# EAGLE design M5R_I2C_MUX (EAGLE 9.6.2)
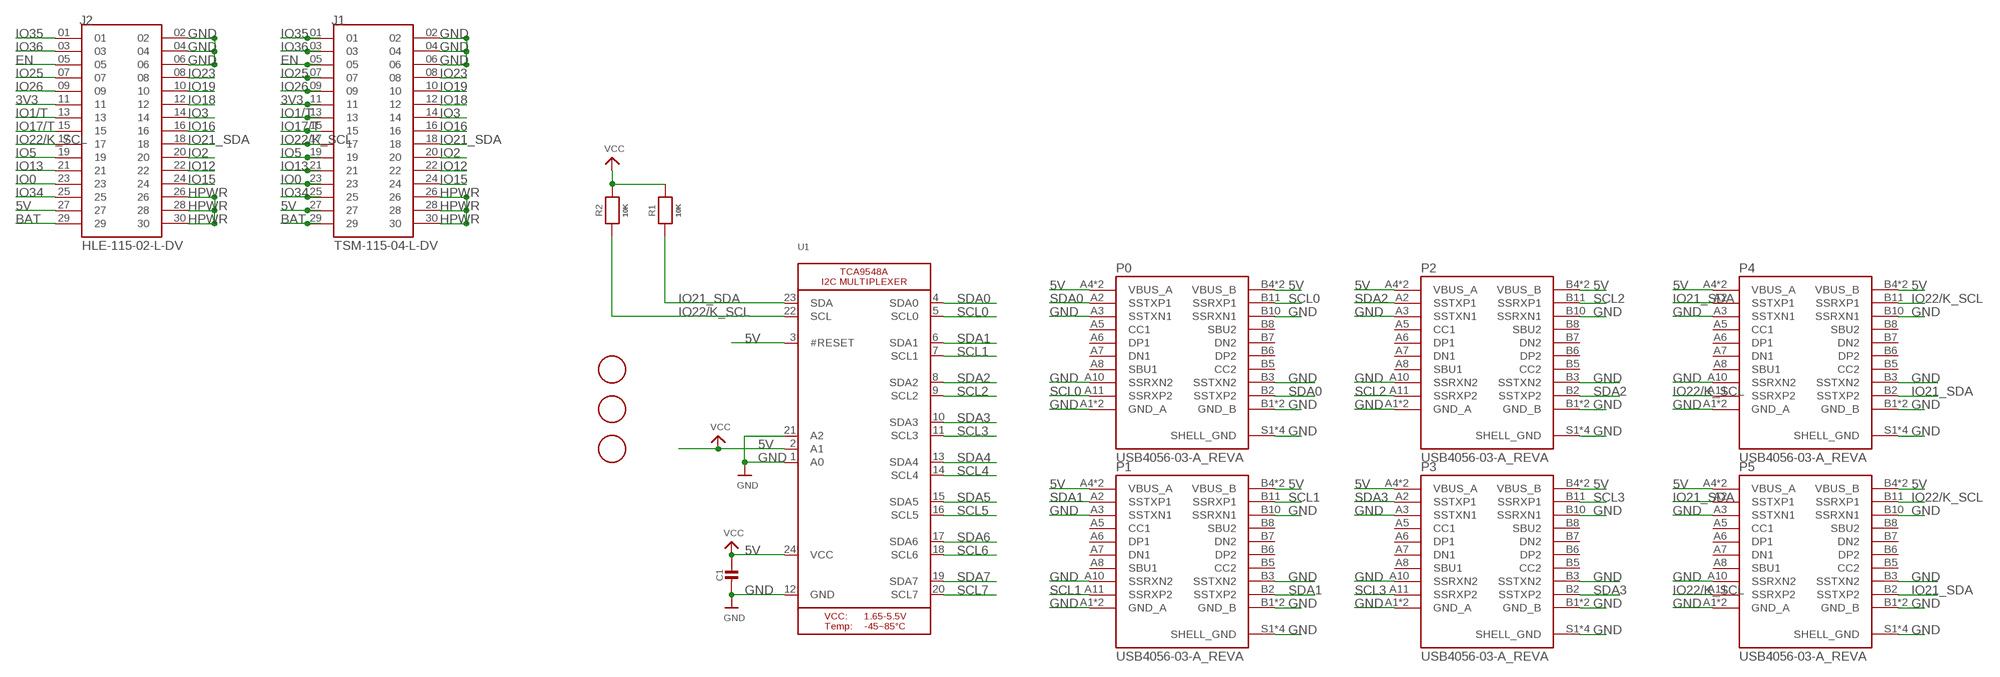
[diagram p0: schematic, sheet 1]

## Parts
C1  CAP_CERAMIC0805-NOOUTLINE  [0805-NO]
J1  TSM-115-04-L-DV  [SAMTEC_TSM-115-04-L-DV]
J2  HLE-115-02-L-DV  [SAMTEC_HLE-115-02-L-DV]
P0  USB4056-03-A_REVA  [GCT_USB4056-03-A_REVA]
P1  USB4056-03-A_REVA  [GCT_USB4056-03-A_REVA]
P2  USB4056-03-A_REVA  [GCT_USB4056-03-A_REVA]
P3  USB4056-03-A_REVA  [GCT_USB4056-03-A_REVA]
P4  USB4056-03-A_REVA  [GCT_USB4056-03-A_REVA]
P5  USB4056-03-A_REVA  [GCT_USB4056-03-A_REVA]
R1  10K  RESISTOR_0805  [0805]
R2  10K  RESISTOR_0805  [0805]
U1  TCA9548A  [TSSOP24]
U$3  FIDUCIAL  [FIDUCIAL_1MM]
U$4  FIDUCIAL  [FIDUCIAL_1MM]
U$5  FIDUCIAL  [FIDUCIAL_1MM]

## Nets
3V3: J1.11 J2.11
5V: C1.1 J1.27 J2.27 P0.A4(VBUS_A) P0.A9(VBUS_A) P0.B4(VBUS_B) P0.B9(VBUS_B) P1.A4(VBUS_A) P1.A9(VBUS_A) P1.B4(VBUS_B) P1.B9(VBUS_B) P2.A4(VBUS_A) P2.A9(VBUS_A) P2.B4(VBUS_B) P2.B9(VBUS_B) P3.A4(VBUS_A) P3.A9(VBUS_A) P3.B4(VBUS_B) P3.B9(VBUS_B) P4.A4(VBUS_A) P4.A9(VBUS_A) P4.B4(VBUS_B) P4.B9(VBUS_B) P5.A4(VBUS_A) P5.A9(VBUS_A) P5.B4(VBUS_B) P5.B9(VBUS_B) R1.2 R2.2 U1.2(A1) U1.3(#RESET) U1.24(VCC) ; supply symbol labelled VCC
BAT: J1.29 J2.29
EN: J1.05 J2.05
GND [New Class]: C1.2 J1.02 J1.04 J1.06 J2.02 J2.04 J2.06 P0.A1(GND_A) P0.A3(SSTXN1) P0.A10(SSRXN2) P0.A12(GND_A) P0.B1(GND_B) P0.B3(SSTXN2) P0.B10(SSRXN1) P0.B12(GND_B) P0.S1(SHELL_GND) P0.S2(SHELL_GND) P0.S3(SHELL_GND) P0.S4(SHELL_GND) P1.A1(GND_A) P1.A3(SSTXN1) P1.A10(SSRXN2) P1.A12(GND_A) P1.B1(GND_B) P1.B3(SSTXN2) P1.B10(SSRXN1) P1.B12(GND_B) P1.S1(SHELL_GND) P1.S2(SHELL_GND) P1.S3(SHELL_GND) P1.S4(SHELL_GND) P2.A1(GND_A) P2.A3(SSTXN1) P2.A10(SSRXN2) P2.A12(GND_A) P2.B1(GND_B) P2.B3(SSTXN2) P2.B10(SSRXN1) P2.B12(GND_B) P2.S1(SHELL_GND) P2.S2(SHELL_GND) P2.S3(SHELL_GND) P2.S4(SHELL_GND) P3.A1(GND_A) P3.A3(SSTXN1) P3.A10(SSRXN2) P3.A12(GND_A) P3.B1(GND_B) P3.B3(SSTXN2) P3.B10(SSRXN1) P3.B12(GND_B) P3.S1(SHELL_GND) P3.S2(SHELL_GND) P3.S3(SHELL_GND) P3.S4(SHELL_GND) P4.A1(GND_A) P4.A3(SSTXN1) P4.A10(SSRXN2) P4.A12(GND_A) P4.B1(GND_B) P4.B3(SSTXN2) P4.B10(SSRXN1) P4.B12(GND_B) P4.S1(SHELL_GND) P4.S2(SHELL_GND) P4.S3(SHELL_GND) P4.S4(SHELL_GND) P5.A1(GND_A) P5.A3(SSTXN1) P5.A10(SSRXN2) P5.A12(GND_A) P5.B1(GND_B) P5.B3(SSTXN2) P5.B10(SSRXN1) P5.B12(GND_B) P5.S1(SHELL_GND) P5.S2(SHELL_GND) P5.S3(SHELL_GND) P5.S4(SHELL_GND) U1.1(A0) U1.12(GND) U1.21(A2)
HPWR: J1.26 J1.28 J1.30 J2.26 J2.28 J2.30
IO0: J1.23 J2.23
IO1/T: J1.13 J2.13
IO2: J1.20 J2.20
IO3: J1.14 J2.14
IO5: J1.19 J2.19
IO12: J1.22 J2.22
IO13: J1.21 J2.21
IO15: J1.24 J2.24
IO16: J1.16 J2.16
IO17/T: J1.15 J2.15
IO18: J1.12 J2.12
IO19: J1.10 J2.10
IO21_SDA: J1.18 J2.18 P4.A2(SSTXP1) P4.B2(SSTXP2) P5.A2(SSTXP1) P5.B2(SSTXP2) R1.1 U1.23(SDA)
IO22/K_SCL: J1.17 J2.17 P4.A11(SSRXP2) P4.B11(SSRXP1) P5.A11(SSRXP2) P5.B11(SSRXP1) R2.1 U1.22(SCL)
IO23: J1.08 J2.08
IO25: J1.07 J2.07
IO26: J1.09 J2.09
IO34: J1.25 J2.25
IO35: J1.01 J2.01
IO36: J1.03 J2.03
SCL0: P0.A11(SSRXP2) P0.B11(SSRXP1) U1.5(SCL0)
SCL1: P1.A11(SSRXP2) P1.B11(SSRXP1) U1.7(SCL1)
SCL2: P2.A11(SSRXP2) P2.B11(SSRXP1) U1.9(SCL2)
SCL3: P3.A11(SSRXP2) P3.B11(SSRXP1) U1.11(SCL3)
SCL4: U1.14(SCL4)
SCL5: U1.16(SCL5)
SCL6: U1.18(SCL6)
SCL7: U1.20(SCL7)
SDA0: P0.A2(SSTXP1) P0.B2(SSTXP2) U1.4(SDA0)
SDA1: P1.A2(SSTXP1) P1.B2(SSTXP2) U1.6(SDA1)
SDA2: P2.A2(SSTXP1) P2.B2(SSTXP2) U1.8(SDA2)
SDA3: P3.A2(SSTXP1) P3.B2(SSTXP2) U1.10(SDA3)
SDA4: U1.13(SDA4)
SDA5: U1.15(SDA5)
SDA6: U1.17(SDA6)
SDA7: U1.19(SDA7)
Unconnected: P0.A5(CC1) P0.A6(DP1) P0.A7(DN1) P0.A8(SBU1) P0.B5(CC2) P0.B6(DP2) P0.B7(DN2) P0.B8(SBU2) P1.A5(CC1) P1.A6(DP1) P1.A7(DN1) P1.A8(SBU1) P1.B5(CC2) P1.B6(DP2) P1.B7(DN2) P1.B8(SBU2) P2.A5(CC1) P2.A6(DP1) P2.A7(DN1) P2.A8(SBU1) P2.B5(CC2) P2.B6(DP2) P2.B7(DN2) P2.B8(SBU2) P3.A5(CC1) P3.A6(DP1) P3.A7(DN1) P3.A8(SBU1) P3.B5(CC2) P3.B6(DP2) P3.B7(DN2) P3.B8(SBU2) P4.A5(CC1) P4.A6(DP1) P4.A7(DN1) P4.A8(SBU1) P4.B5(CC2) P4.B6(DP2) P4.B7(DN2) P4.B8(SBU2) P5.A5(CC1) P5.A6(DP1) P5.A7(DN1) P5.A8(SBU1) P5.B5(CC2) P5.B6(DP2) P5.B7(DN2) P5.B8(SBU2)

## Library data of the parts
C1 = M5stack_Racing:CAP_CERAMIC: Ceramic Capacitors For new designs, use the packages preceded by an '_' character since they are more reliable: The following footprints should be used on most boards: _0402 - Standard footprint for regular board layouts _0603 - Standard footprint for regular board layouts _0805 - Standard footprint for regular board layouts _1206 - Standard footprint for regular board layouts For extremely tight-pitch boards where space is at a premium, the following 'micro-pitch' footprints can be used (smaller pads, no silkscreen outline, etc.): _0402MP - Micro-pitch footprint for very dense/compact boards _0603MP - Micro-pitch footprint for very dense/compact boards _0805MP - Micro-pitch footprint for very dense/compact boards _1206MP - Micro-pitch footprint for very dense/compact boards
J1 = M5stack_Racing:TSM-115-04-L-DV: Check availability <https://pricing.snapeda.com/parts/TSM-115-04-L-DV/Samtec/view-part?ref=eda>; AVAILABILITY: In Stock; DESCRIPTION: Connector Header Surface Mount 30 position 0.100 (2.54mm); MF: Samtec; MP: TSM-115-04-L-DV; PACKAGE: None; PRICE: None; PURCHASE-URL: https://pricing.snapeda.com/search/part/TSM-115-04-L-DV/?ref=eda
J2 = M5stack_Racing:HLE-115-02-L-DV; MANUFACTURER: Samtec Inc.; PARTREV: R; STANDARD: Manufacturer Recommendations
P0 P1-P5 = M5stack_Racing:USB4056-03-A_REVA; MANUFACTURER: GCT; MAXIMUM_PACKAGE_HEIGHT: 3.31 mm; PARTREV: A; STANDARD: Manufacturer Recommendations
R1 R2 = M5stack_Racing:RESISTOR: Resistors For new designs, use the packages preceded by an '_' character since they are more reliable: The following footprints should be used on most boards: _0402 - Standard footprint for regular board layouts _0603 - Standard footprint for regular board layouts _0805 - Standard footprint for regular board layouts _1206 - Standard footprint for regular board layouts For extremely tight-pitch boards where space is at a premium, the following 'micro-pitch' footprints can be used (smaller pads, no silkscreen outline, etc.): _0402MP - Micro-pitch footprint for very dense/compact boards _0603MP - Micro-pitch footprint for very dense/compact boards _0805MP - Micro-pitch footprint for very dense/compact boards _1206MP - Micro-pitch footprint for very dense/compact boards
U1 = M5stack_Racing:TCA9548A: TCA9548A I2C Multiplexer
U$3-U$5 = M5stack_Racing:FIDUCIAL: For use by pick and place machines to calibrate the vision/machine, 1mm By microbuilder.eu

## Board
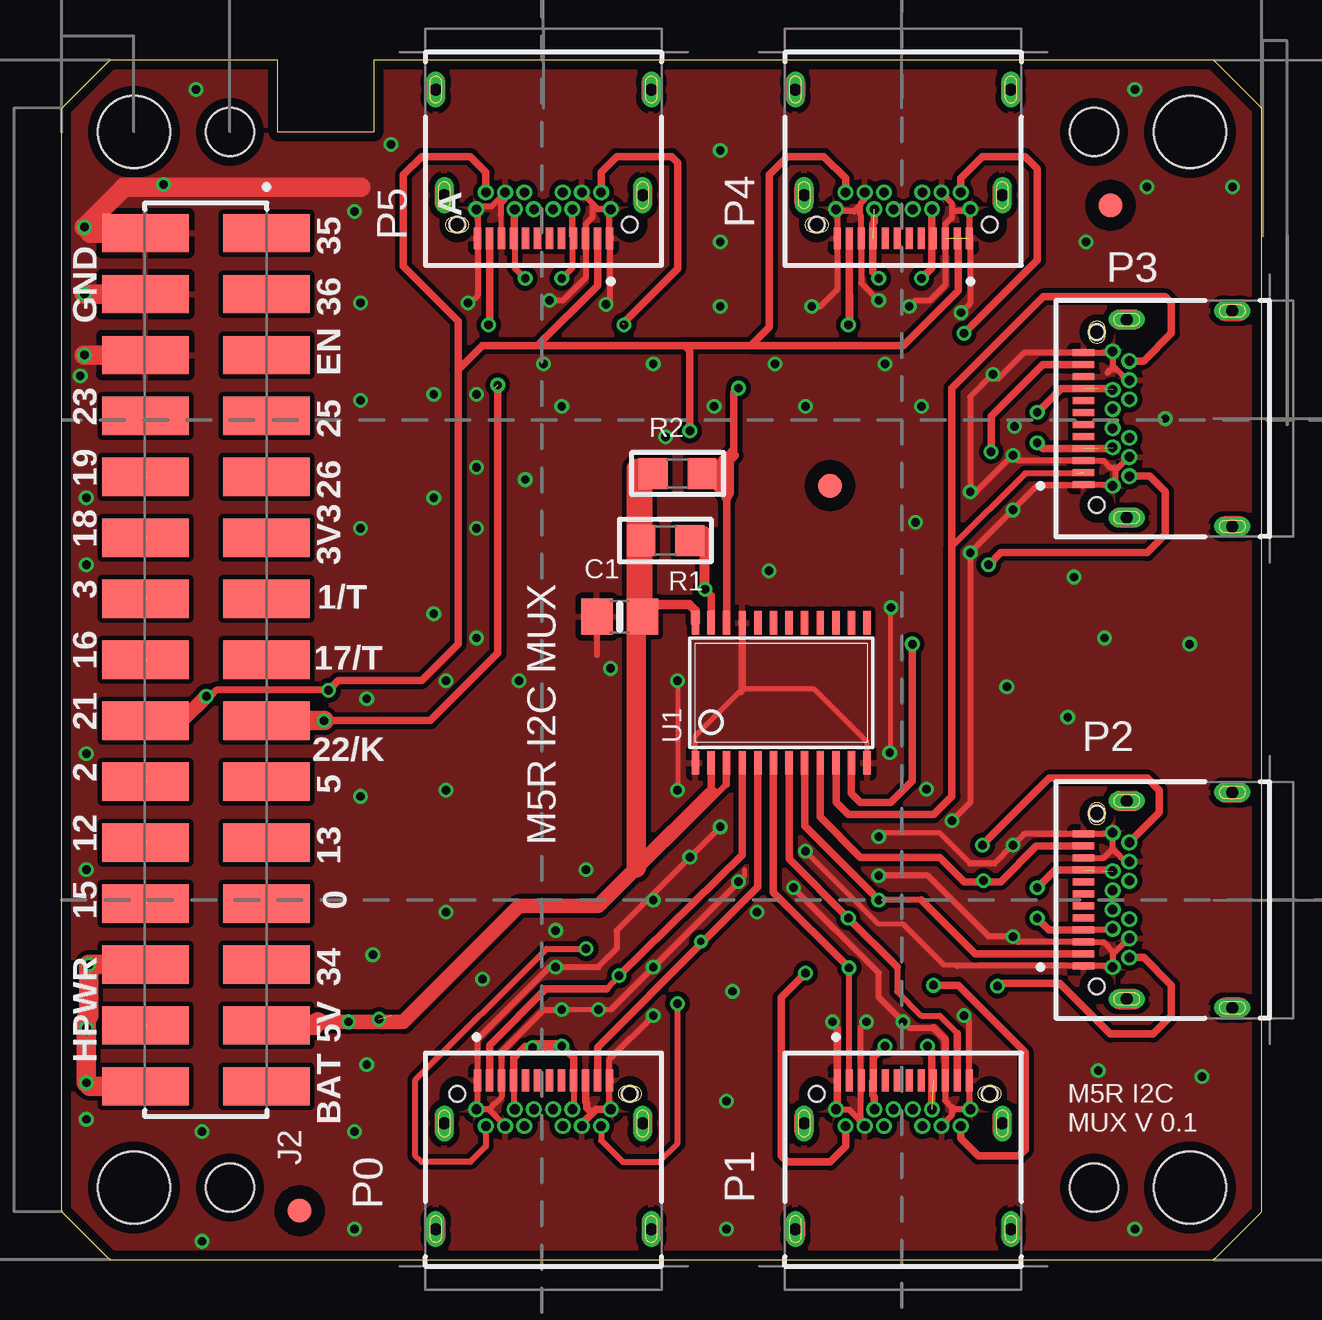
[diagram p1: board, top side]
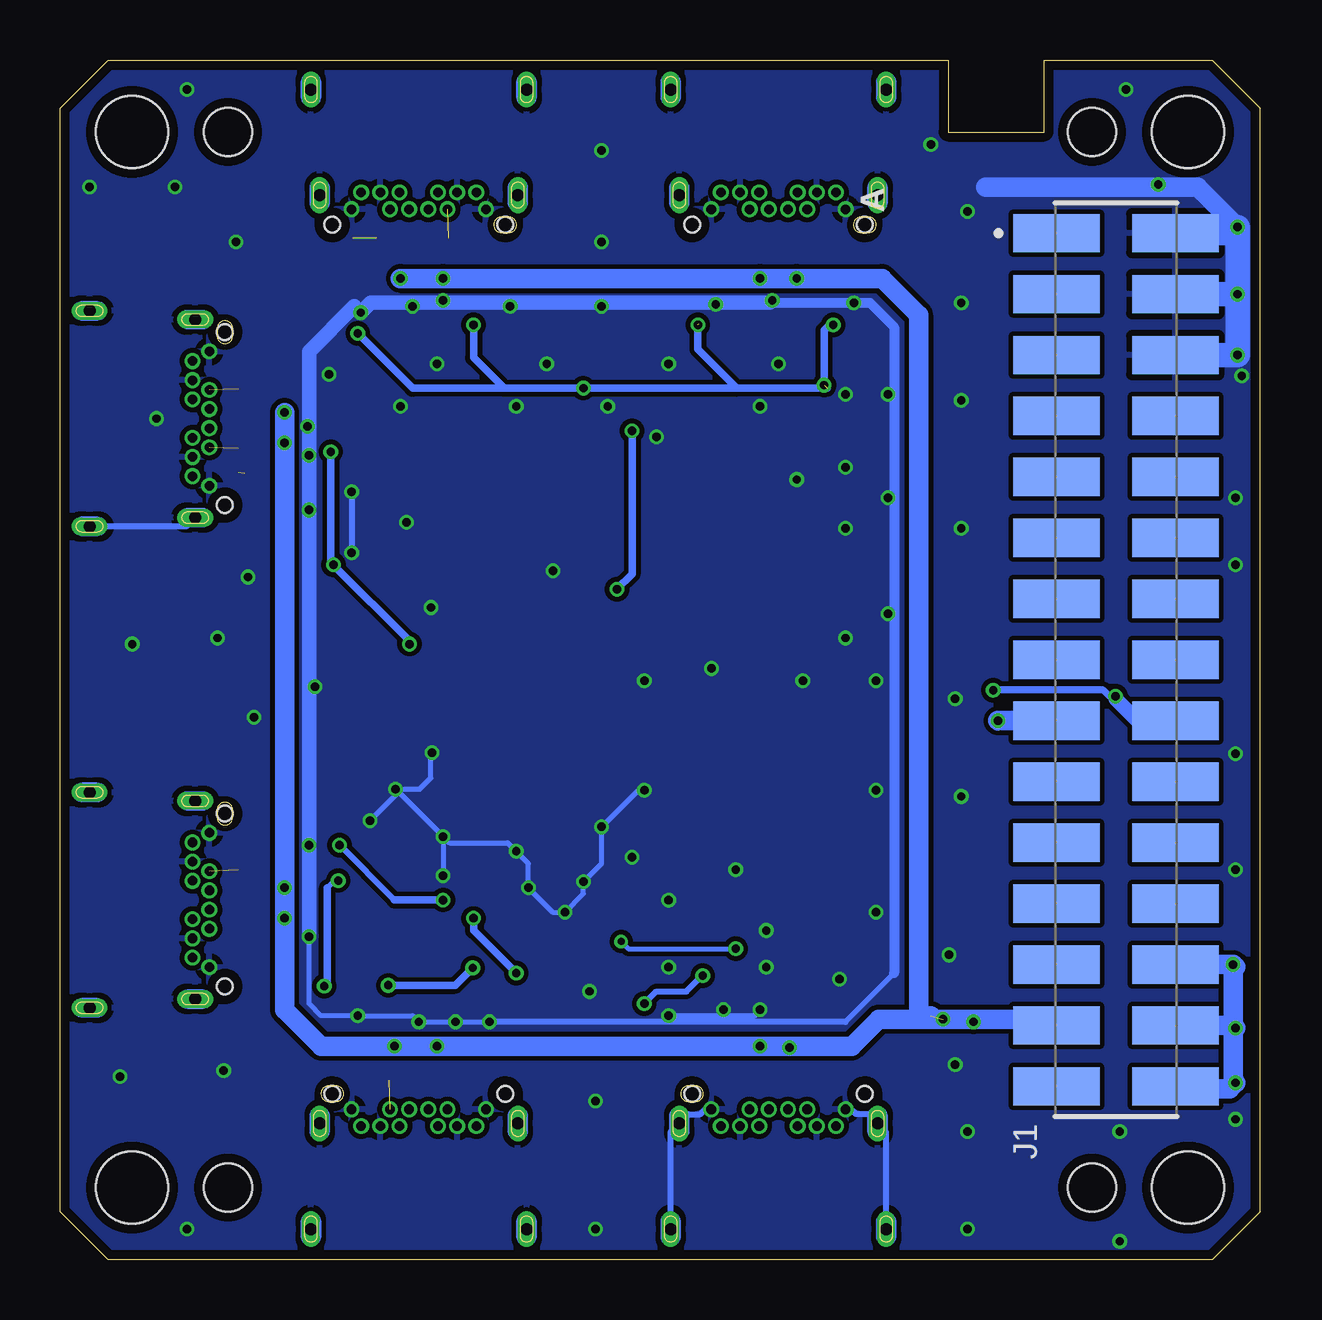
[diagram p2: board, bottom side, seen from below]

Size 50 x 50 mm. Coordinates in mm from the lower left corner, seen from the top.
Outline: 0,2 2,0 48,0 50,2 50,48 48,50 13,50 13,47 9,47 9,50 2,50 0,48 0,2
Copper layers (1*16): Top 0.035mm / dielectric 1.5mm / Bottom 0.035mm
Design rules "PCBway *": minimum track width 0.2mm, minimum drill 0.2mm, track to track 0.2mm, track to pad 0.125mm, pad to pad 0.125mm, via to via 0.205mm, smd to smd 8mil, copper to edge 0.4mm, drill to drill 0.4mm, minimum pad ring 0.13mm, minimum via ring 0.13mm, stop-mask expansion 4mil, vias tented up to drill 25mil, thermal gap 10mil
Holes 3 mm at 3,3 3,47 47,47 47,3
Holes 2 mm at 7,3 7,47 43,47 43,3

### Footprints (pad centres in the part's own frame; a part is rotated, then mirrored left to right if it is on the bottom)
0805-NO = smd 1.3 x 1.5: 1 -0.95,0; 2 0.95,0
SAMTEC_TSM-115-04-L-DV = smd 1.6 x 3.6: 01 17.78,2.475; 02 17.78,-2.475; 03 15.24,2.475; 04 15.24,-2.475; 05 12.7,2.475; 06 12.7,-2.475; 07 10.16,2.475; 08 10.16,-2.475; 09 7.62,2.475; 10 7.62,-2.475; 11 5.08,2.475; 12 5.08,-2.475; 13 2.54,2.475; 14 2.54,-2.475; 15 0,2.475; 16 0,-2.475; 17 -2.54,2.475; 18 -2.54,-2.475; 19 -5.08,2.475; 20 -5.08,-2.475; 21 -7.62,2.475; 22 -7.62,-2.475; 23 -10.16,2.475; 24 -10.16,-2.475; 25 -12.7,2.475; 26 -12.7,-2.475; 27 -15.24,2.475; 28 -15.24,-2.475; 29 -17.78,2.475; 30 -17.78,-2.475
SAMTEC_HLE-115-02-L-DV = smd 1.6 x 3.6: 01 17.78,-2.525; 02 17.78,2.525; 03 15.24,-2.525; 04 15.24,2.525; 05 12.7,-2.525; 06 12.7,2.525; 07 10.16,-2.525; 08 10.16,2.525; 09 7.62,-2.525; 10 7.62,2.525; 11 5.08,-2.525; 12 5.08,2.525; 13 2.54,-2.525; 14 2.54,2.525; 15 0,-2.525; 16 0,2.525; 17 -2.54,-2.525; 18 -2.54,2.525; 19 -5.08,-2.525; 20 -5.08,2.525; 21 -7.62,-2.525; 22 -7.62,2.525; 23 -10.16,-2.525; 24 -10.16,2.525; 25 -12.7,-2.525; 26 -12.7,2.525; 27 -15.24,-2.525; 28 -15.24,2.525; 29 -17.78,-2.525; 30 -17.78,2.525
GCT_USB4056-03-A_REVA = smd 0.3 x 0.9: A1 -2.75,6.2; A2 -2.25,6.2; A3 -1.75,6.2; A4 -1.25,6.2; A5 -0.75,6.2; A6 -0.25,6.2; A7 0.25,6.2; A8 0.75,6.2; A9 1.25,6.2; A10 1.75,6.2; A11 2.25,6.2; A12 2.75,6.2 | drill 0.4 pad 0.6: B1 2.8,4.99; B2 2.4,4.29; B3 1.6,4.29; B4 1.2,4.99; B5 0.8,4.29; B6 0.4,4.99; B7 -0.4,4.99; B8 -0.8,4.29; B9 -1.2,4.99; B10 -1.6,4.29; B11 -2.4,4.29; B12 -2.8,4.99 | drill 0.5 pad 0.6 long: S1 -4.13,4.4; S2 4.13,4.4; S3 -4.49,0; S4 4.49,0 | hole 0.65: 3.6,5.64; -3.6,5.64
0805 = smd 1.2 x 1.3: 1 -1.016,0; 2 1.016,0
TSSOP24 = smd 0.305 x 0.991: 1 -3.575,-2.918; 2 -2.925,-2.918; 3 -2.275,-2.918; 4 -1.625,-2.918; 5 -0.975,-2.918; 6 -0.325,-2.918; 7 0.325,-2.918; 8 0.975,-2.918; 9 1.625,-2.918; 10 2.275,-2.918; 11 2.925,-2.918; 12 3.575,-2.918; 13 3.575,2.918; 14 2.925,2.918; 15 2.275,2.918; 16 1.625,2.918; 17 0.975,2.918; 18 0.325,2.918; 19 -0.325,2.918; 20 -0.975,2.918; 21 -1.625,2.918; 22 -2.275,2.918; 23 -2.925,2.918; 24 -3.575,2.918
FIDUCIAL_1MM = smd 1 x 1: 1 0,0

### Placement (x,y rotation side)
C1  23.24,26.8 180 top
J1  6,25 90 bottom
J2  6,25 90 top
P0  20.07,1.27 0 top
P1  35.05,1.27 0 top
P2  48.77,14.99 90 top
P3  48.77,35.05 90 top
P4  35.05,48.77 180 top
P5  20.07,48.77 180 top
R1  25.15,29.97 180 top
R2  25.65,32.77 180 top
U1  29.97,23.62 0 top
U$3  43.69,43.94 0 top
U$4  9.91,2.03 0 top
U$5  32,32.26 0 top

### Tracks (layer width: path | path; a pad name or v marks a point on that pad's centre or on a via)
3V3  (1 unrouted)
5V  (via drill 0.35)  (7 unrouted)
  Top 0.2: 19.3,8.89 19.56,8.89 | 20.78,8.84 v20.83,8.89 | U1.3 27.69,20.69 | 22.61,14.73 19.05,14.73 | 33.85,41.08 33.91,41.02 | 24.13,33.02 24.13,32.77 | 24.13,32.77 R1.2 | 24.13,32.77 23.94,32.96 | 24.13,32.26 R2.2
  Top 0.203: P4.A4 36.25,42.62 P4.B9
  Top 0.254: 27.69,19.81 22.61,14.73 | P0.A4 18.82,6.31 P0.B9 | P0.A9 21.32,6.31 P0.B4 | 33.78,7.45 P1.A4 | 43.73,16.24 P2.B4 | P2.B9 43.73,13.74 P2.A4 | 43.73,36.3 P3.B4 | 43.73,33.8 P3.B9 | 33.85,43.25 33.78,43.18 | 33.78,41.15 33.91,41.02 | v20.83,40.89 21.27,41.33 P5.B9 21.27,42.62 P5.A4 | v19.3,40.89 18.87,41.33 P5.B4 18.82,43.73 P5.A9 | R1.2 24.13,32.26
  Top 0.305: 19.3,8.89 18.82,8.4 P0.A4 | v20.83,8.89 21.32,8.4 P0.A9 | v19.61,8.84 19.56,8.89 | v40.64,15.49 41.38,16.24 43.73,16.24 | 27.69,20.69 27.69,19.81 | U1.2 27.05,19.43 | v40.64,35.31 41.64,36.3 43.73,36.3 | v40.64,34.04 40.87,33.8 43.73,33.8 | 33.91,41.02 v34.04,40.89 | P1.A4 33.8,8.4 v34.29,8.89 | P1.B4 36.25,8.71 v36.07,8.89 | P1.B9 33.85,6.79 33.78,6.86 33.78,7.45 | P2.A4 41.13,13.74 v40.64,14.22 | P4.B4 33.85,43.25 | 33.78,43.18 33.78,41.15 | v35.81,40.89 36.25,41.33 P4.B9
  Top 0.4: U1.24 26.4,27.05 26.14,27.3 24.7,27.3 C1.1
  Top 0.61: v19.61,8.84 20.78,8.84 | 27.05,19.43 23.94,16.32 22.35,14.73 19.05,14.73 14.22,9.91 13.32,9.91 | 9.14,9.91 10.67,9.91 v11.94,9.91 13.32,9.91 | 13.32,9.91 v13.21,10.01
  Top 0.813: C1.1 24.26,26.8 | C1.1 23.94,26.54 23.94,16.32 | 23.94,32.96 23.94,27.05 | C1.1 24.19,32.96 24.13,33.02 | 10.67,9.91 10.52,9.76 J2.27
  Bottom 0.2: v19.61,8.84 19.66,8.89 20.07,8.89
  Bottom 0.813: 9.01,10.01 v13.21,10.01 15.89,10.01 17.02,8.89 20.07,8.89 v34.29,8.89 v36.07,8.89 39.12,8.89 40.64,10.41 v40.64,14.22 v40.64,15.49 v40.64,34.04 v40.64,35.31 | 13.72,10.16 14.22,10.16 14.22,39.37 15.75,40.89 v19.3,40.89 v20.83,40.89 v34.04,40.89 v35.81,40.89
BAT  (1 unrouted)
EN  (1 unrouted)
GND  (via drill 0.35)  (1 unrouted)
  Top 0.2: v28.19,15.75 28.45,16 28.45,16.26 | 22.86,10.41 v20.83,10.41 | 35.31,9.65 v35.05,9.91 | 32.3,9.61 32,9.91 v32.11,9.91 | 39.79,12.24 37.29,12.24 37.27,12.26 36.76,12.26 35.05,13.97 34.04,13.97 v30.99,17.02 | 37.85,16.51 36.58,17.78 34.19,17.78 v34.04,17.63 | U1.1 26.4,21.82 28.35,23.77 28.45,23.77 | U1.12 33.55,21.57 31.34,23.77 28.45,23.77 | 28.3,23.62 28.45,23.77 | v34.49,21.13 34.54,21.18 v34.54,27.18 | v25.65,24.13 v25.65,19.56 | P5.A10 18.29,42.6 18.29,43.53
  Top 0.254: v20.83,10.41 20.07,10.41 18.32,8.66 P0.A3 18.32,6.79 17.79,6.26 | v28.19,15.75 22.86,10.41 | 35.31,9.65 36.32,9.65 | v35.05,9.91 34.04,10.92 34.04,11.94 v30.48,15.49 | v34.04,16 36.07,16 38.61,13.46 v39.62,13.46 39.85,13.24 P2.A3 43.41,13.24 43.85,12.79 | v27.43,18.03 23.11,13.72 23.11,12.95 22.35,12.19 v20.57,12.19 20.32,12.19 17.32,9.19 P0.A1 17.32,7.26 17.32,6.56 17.27,6.5 P0.B12 17.79,6.26 | 37.85,16.51 38.86,16.51 v39.62,17.27 40.09,17.74 42.77,17.74 42.77,17.73 43.73,17.73 P2.B1 43.78,17.11 | C1.2 22.29,25.21 | P0.B10 18.25,5.78 18.25,5.8 17.79,6.26 | P0.B1 22.87,6.5 22.81,6.56 22.81,8.34 v24.64,10.16 | 22.26,6.26 22.35,6.26 | 21.67,5.66 21.84,5.84 | 32.3,9.61 | 32.3,6.31 P1.B12 32.77,6.26 33.23,5.8 33.23,5.78 33.27,5.74 | 33.27,5.74 P1.B10 | v33.53,9.91 33.27,9.65 33.27,5.74 | P1.A10 36.8,6.63 37.08,6.35 | 37.08,6.35 37.08,6.01 36.87,5.8 36.87,5.78 P1.B3 | 37.08,6.35 37.17,6.26 P1.B1 37.85,6.5 37.8,6.56 37.8,7.26 P1.A12 37.8,9.95 v37.59,10.16 | P2.A10 43.41,16.74 43.78,17.11 | P2.B3 44.3,16.59 43.78,17.11 | 37.29,12.24 P2.A1 42.77,12.24 43.48,12.24 43.53,12.19 P2.B12 43.78,12.71 43.85,12.79 | P2.B10 44.26,13.17 44.24,13.17 43.85,12.79 | 44.02,33.02 43.69,33.02 43.41,33.3 P3.A3 39.85,33.3 v39.62,33.53 38.1,32 v37.85,32 37.85,35.95 v38.79,36.9 38.99,36.7 40.09,37.8 P3.A12 | 44.02,33.02 44.24,33.23 44.26,33.23 P3.B10 | 44.02,33.02 43.9,32.89 43.9,32.37 P3.B12 43.73,32.3 42.77,32.3 P3.A1 42.52,32.26 40.64,32.26 v39.62,31.24 v37.85,29.46 37.85,19.05 v37.08,18.29 | P3.B3 44.37,36.65 43.94,37.08 | 43.94,37.08 43.69,37.08 43.56,36.96 | v39.69,34.73 39.62,34.8 | P3.B1
  Top 0.254: P3.B1 43.78,37.25 43.94,37.08 | P3.B1 43.53,37.85 43.48,37.8 42.77,37.8 | v37.47,39.47 37.85,39.85 37.85,42.73 37.8,42.77 37.8,43.48 37.85,43.53 P4.B12 37.76,43.69 37.08,43.69 | v35.31,39.72 35.56,39.98 36.17,39.98 36.8,40.61 P4.A3 36.8,43.15 37.08,43.43 37.08,43.69 | P4.B1 32.25,43.69 | 32.25,43.69 32.25,43.53 32.3,43.48 32.3,42.77 P4.A12 32.3,40.43 31.6,39.72 v31.24,39.72 | P4.B3 33.45,44.2 33.27,44.02 33.27,43.94 | 33.27,43.94 33.02,43.69 32.25,43.69 | 33.27,43.94 33.27,43.54 33.3,43.51 P4.A10 33.3,40.71 v34.04,39.98 | P4.B10 36.87,44.26 36.87,44.24 37.08,44.02 37.08,43.69 | P5.B10 21.88,44.26 21.88,44.24 22.1,44.02 | 22.1,44.02 22.1,43.43 21.82,43.15 P5.A3 21.82,40.92 20.87,39.98 v20.32,39.98 | 22.1,44.02 22.34,43.78 P5.B12 22.81,43.73 22.81,42.77 22.82,42.77 P5.A1 22.82,39.83 22.73,39.75 v22.68,39.81 | 18.29,43.53 18.28,43.54 18.28,44.02 18.47,44.2 P5.B3 18.25,44.26 18.25,44.24 17.91,43.9 17.38,43.9 P5.B1 17.27,43.53 17.32,43.48 17.32,42.77 P5.A12 17.32,40.18 17.02,39.88 v16.93,39.88
  Top 0.305: 28.35,23.77 U1.21 | 32.3,9.61 32.3,6.31 | 22.26,6.26 22.1,6.1 | P0.B3 21.67,5.66 22.1,6.1 | 22.1,6.1 21.87,6.32 21.87,6.51 21.82,6.57 21.82,7.26 21.83,7.24 | 22.35,6.26 P0.B1 | 36.32,9.65 36.8,9.18 P1.A10
  Top 0.813: J2.06 v0.94,37.7 | J2.04 v0.94,40.24 | J2.02 1.19,42.78 v0.94,43.03 2.6,44.69 3.96,44.69 3.97,44.7 12.45,44.7
  Bottom 0.2: v32.11,9.91 v33.53,9.91 v35.05,9.91 35.31,10.16 v37.59,10.16 39.12,10.16 39.62,10.67 v39.62,13.46 | 15.24,11.94 17.27,9.91 | v34.04,17.63 33.78,17.37 31.34,17.37 v30.99,17.02 30.48,16.51 v30.48,15.49 29.46,14.48 v28.96,14.48 28.19,15.24 v28.19,15.75 27.43,16.51 v27.43,18.03 25.91,19.56 v25.65,19.56 | v34.04,17.63 v34.04,16 | v36.02,19.61 v34.04,17.63 | v36.02,19.61 35.89,19.48 v37.08,18.29 | v36.02,19.61 35,19.61 34.54,20.07 34.54,21.08 v34.49,21.13
  Bottom 0.254: 17.27,9.91 v32.11,9.91 | v24.64,10.16 21.08,10.16 v20.83,10.41 | v37.85,32 v37.85,29.46 | P0.S3 15.58,5.31 P0.S1 16.32,6.06 16.82,6.06 17.02,6.26 P0.B12 | P0.S4 24.56,5.31 P0.S2 23.81,6.06 23.31,6.06 23.11,6.26 P0.B1 | v37.47,39.47 37.73,39.74 | v35.31,39.72 35.31,39.98 | P3.S1 44.73,30.56 P3.S3
  Bottom 0.406: v20.32,39.98 20.22,39.88 v16.93,39.88 16.26,39.88 15.24,38.86 15.24,11.94
  Bottom 0.61: v39.62,13.46 v39.62,31.24 v39.62,33.53 39.62,37.85 37.73,39.74 | v37.47,39.47 37.06,39.88 20.42,39.88 v20.32,39.98
  Bottom 0.813: v0.94,43.03 2.6,44.69 3.96,44.69 3.97,44.7 11.43,44.7
  Bottom 1.016: J1.06 v0.94,37.7 v0.94,40.24 | J1.04 v0.94,40.24 | J1.02 1.19,42.78 v0.94,43.03 v0.94,40.24
  other vias: 27.43,42.42 27.43,46.23 42.67,42.42 45.21,44.7 44.7,48.77 48.77,44.7 45.97,35.05 46.99,25.65 43.43,25.91 43.18,7.87 47.5,7.62 44.7,1.27 27.69,1.27 27.69,6.6 12.19,1.27 12.19,5.33 5.84,5.33 5.84,0.76 1.02,5.84 5.59,48.77 17.27,36.07 17.27,33.02 17.27,30.48 17.27,25.91 16,24.13 12.7,23.37 15.49,36.07 15.49,31.75 20.57,13.72 17.53,11.68 24.64,14.99 26.16,16.76 24.64,12.19 22.35,10.41 27.94,11.18 4.24,44.81 35.81,35.56 30.99,35.56 29.46,28.7 35.56,30.73 20.83,35.56 19.05,24.13 16,19.56 16,14.48 21.84,16.26 22.86,24.64 19.3,32.51 12.19,43.69 12.45,39.88 12.45,35.81 12.45,30.48 12.45,19.3 13.72,46.48 15.49,26.92 39.37,23.88 42.16,28.45 41.91,22.61 12.95,12.7 12.7,8.13 1.02,31.75 0.76,36.83 1.02,28.96 1.02,21.08 1.02,16.26 27.18,35.56 25.15,34.29 24.64,37.34 20.07,37.34 29.72,37.34 34.29,37.34 27.43,39.72
  pour Top: -0.25,50.8 48.51,50.8 52.58,46.74 52.58,1.78 49.02,-1.78 2.03,-1.78 -3.05,3.3 -3.05,48.01
  pour Bottom: -1.02,50.04 49.28,50.04 52.58,46.74 52.58,1.78 49.02,-1.78 2.03,-1.78 -3.05,3.3 -3.05,48.01
HPWR  (via drill 0.35)  (1 unrouted)
  Top 0.813: J2.26 v1.12,12.3 1.12,10.16 1.02,10.05 v1.02,9.65 v1.02,7.37 1.16,7.22 J2.30
  Bottom 0.813: J1.26 v1.12,12.3 | v1.12,12.3 1.02,12.19 | v1.02,9.65 1.12,9.76 J1.28 | J1.30 3.42,7.11 1.27,7.11 v1.02,7.37 1.12,7.47 v1.12,12.3
IO0  (1 unrouted)
IO1/T  (1 unrouted)
IO2  (1 unrouted)
IO3  (1 unrouted)
IO5  (1 unrouted)
IO12  (1 unrouted)
IO13  (1 unrouted)
IO15  (1 unrouted)
IO16  (1 unrouted)
IO17/T  (1 unrouted)
IO18  (1 unrouted)
IO19  (1 unrouted)
IO21_SDA  (via drill 0.35)
  Top 0.2: 26.79,30.36 26.41,29.97 R1.1
  Top 0.203: 6.17,23.48 v6.02,23.48
  Top 0.254: 26.16,37.85 25.91,38.1 | P4.A2 37.32,42.55 37.34,42.55
  Top 0.3: v11.11,23.73 6.43,23.73 6.17,23.48
  Top 0.305: v26.79,27.94 27.05,27.69 U1.23 | 16.51,37.08 16.51,25.65 14.99,24.13 11.51,24.13 v11.11,23.73 | 28.7,38.1 35.05,38.1 37.34,40.38 37.34,42.55 | 28.7,38.1 25.91,38.1 19.81,38.1 | 19.81,38.1 17.52,38.1 16.51,37.08 | v26.16,34.54 26.16,37.85 | P4.B2 32.65,45.07 31.75,45.97 30.23,45.97 29.46,45.21 29.46,38.86 28.7,38.1 | P5.A2 22.32,40.6 19.81,38.1 | P5.B2 17.67,45.33 17.02,45.97 14.99,45.97 14.22,45.21 14.22,41.4 16.51,39.12 16.51,37.08
  Top 0.406: v26.79,27.94 26.79,30.36
  Top 0.61: J2.18 5,22.46 v6.02,23.48
  Bottom 0.2: 6.27,23.48 v6.02,23.48
  Bottom 0.3: v11.11,23.73 6.52,23.73 6.27,23.48
  Bottom 0.305: v26.79,27.94 26.16,28.57 v26.16,34.54
  Bottom 0.61: J1.18 5.11,22.46 6.02,23.37 v6.02,23.48
IO22/K_SCL  (via drill 0.35)  (3 unrouted)
  Top 0.2: v17.78,38.96 17.78,38.86 | 32.8,40.3 32.87,40.23 32.87,39.06 | 32.87,39.06 32.87,39.01 32.77,39.12 | v32.77,38.96 32.87,39.06
  Top 0.203: 27.7,33.48 27.72,33.5
  Top 0.254: 32.8,39.08 32.77,39.12 | v17.78,38.96 17.82,39 | 26.9,32.77 R2.1
  Top 0.305: v10.92,22.46 15.35,22.46 18.16,25.27 v18.16,36.45 | U1.22 27.7,31.75 | v28.19,36.32 28,36.13 28,33.78 | 28,33.78 28,33.53 | 27.72,33.5 28,33.78 | P4.A11 32.8,39.08 | P4.B11 37.45,45.07 38.35,45.97 40.13,45.97 40.64,45.47 40.64,41.66 v37.59,38.61 | P5.B11 22.47,45.33 23.11,45.97 25.4,45.97 25.65,45.72 25.65,41.3 23.37,39.02 | P5.A11 17.82,39
  Top 0.406: R2.1 26.99,32.77 27.59,33.37 27.7,33.26 | 27.7,33.22 28,33.53 | 27.7,31.75 27.7,31.97 | 26.9,32.77 27.7,32.77
  Top 0.6: 27.7,31.97 27.7,32.77 27.7,33.22
  Top 0.61: 27.7,31.97 26.9,32.77
  Top 0.813: v10.92,22.46 J2.17
  Bottom 0.254: v23.42,38.96 23.42,38.92 | 21.84,36.37 21.84,36.32
  Bottom 0.305: v17.78,38.96 17.88,38.86 18.03,38.86 18.16,38.73 v18.16,36.45 | 18.03,36.32 21.84,36.32 v28.19,36.32 31.5,36.32 | 31.5,36.32 35.31,36.32 v37.59,38.61 | v32.77,38.96 32.77,37.59 31.5,36.32 | v23.42,38.96 23.42,37.95 21.84,36.37
  Bottom 0.61: 10.81,22.46 10.92,22.35 v10.92,22.46
  Bottom 0.813: v10.92,22.46 9.25,22.46 9.14,22.35
IO23  (1 unrouted)
IO25  (1 unrouted)
IO26  (1 unrouted)
IO34  (1 unrouted)
IO35  (1 unrouted)
IO36  (1 unrouted)
SCL0  (via drill 0.3, 0.35)
  Top 0.2: 26.62,13.16 v26.62,13.26 26.72,13.26
  Top 0.254: v21.84,12.95 20.19,12.95 14.73,7.49 14.73,4.32 14.99,4.06 17.02,4.06 17.67,4.71 P0.B11
  Top 0.305: U1.5 29,17.78 29,15.54 26.72,13.26 | 26.62,13.16 22.32,8.85 P0.A11
  Bottom 0.2: v26.62,13.26 26.32,12.95 v21.84,12.95
SCL1  (via drill 0.35)
  Top 0.254: 34.8,12.19 34.8,11.18 35.81,10.16 36.58,10.16 37.3,9.43
  Top 0.305: U1.7 30.3,16.69 v32.77,14.22 34.8,12.19 | P1.A11 37.3,9.43 | P1.B11 32.65,4.71 32,4.06 30.23,4.06 29.97,4.32 29.97,10.92 v30.99,11.94
  Bottom 0.305: v30.99,11.94 32.77,13.72 v32.77,14.22
SCL2  (via drill 0.35)
  Top 0.2: 38.99,11.52 v38.99,11.4 | v38.4,15.8 38.56,15.8 38.61,15.75
  Top 0.305: U1.9 31.6,18.44 33.27,16.76 36.58,16.76 37.59,15.75 38.61,15.75 39.12,15.75 40.6,17.24 P2.A11 | P2.B11 45.07,12.59 46.23,11.43 46.23,10.16 45.47,9.4 43.69,9.4 41.57,11.52 38.99,11.52
  Bottom 0.2: v38.99,11.4 38.86,11.4 | 38.86,15.49 38.56,15.8 v38.4,15.8
  Bottom 0.305: 38.86,11.4 38.86,15.49
SCL3  (via drill 0.35)
  Top 0.305: U1.11 32.9,19.43 33.27,19.05 34.54,19.05 35.43,19.94 v35.43,25.65 | v38.72,33.67 38.72,35.16 40.86,37.3 P3.A11 | P3.B11 45.33,32.65 45.97,32 45.97,30.23 45.21,29.46 39.12,29.46 v38.61,28.96
  Bottom 0.2: 38.72,29.07 v38.61,28.96 | 35.43,25.78 v35.43,25.65
  Bottom 0.305: v38.72,33.67 38.72,29.07 | v38.61,28.96 35.43,25.78
SDA0  (via drill 0.35)
  Top 0.254: 22.7,11.28 v23.22,11.84 | P0.B2 22.47,4.97 23.37,4.06 24.89,4.06 25.65,4.83 v25.65,10.67
  Top 0.305: U1.4 28.35,18.06 28.35,16.87 v23.22,11.84 | 22.7,11.28 20.17,11.28 17.82,8.93 P0.A2
  Bottom 0.2: 23.25,11.84 v23.22,11.84
  Bottom 0.254: v25.65,10.67 25.15,11.18 23.91,11.18 23.25,11.84
SDA1  (via drill 0.35)
  Top 0.254: P1.A2 v32.8,12.16
  Top 0.305: U1.6 29.65,15.31 v32.8,12.16 | v36.32,11.43 37.34,11.43 40.13,8.64 40.13,4.57 39.88,4.32 38.19,4.32 37.45,5.05 P1.B2
  Bottom 0.305: v36.32,11.43 33.53,11.43 v32.8,12.16
SDA2  (via drill 0.35)
  Top 0.2: v34.04,14.99 33.78,15.24
  Top 0.254: 35.81,14.99 v34.04,14.99
  Top 0.305: U1.8 30.95,18.07 33.78,15.24 | 35.81,14.99 38.06,12.74 P2.A2 | P2.B2 45.72,18.63 45.72,19.56 45.21,20.07 41.15,20.07 v38.35,17.27
  Bottom 0.254: v38.35,17.27 36.07,14.99
  Bottom 0.305: 36.07,14.99 v34.04,14.99
SDA3  (1 unrouted)
  Top 0.2: U1.10
  Top 0.254: 42.29,32.77 40.13,32.77 37.08,29.72
  Top 0.305: U1.10 32.26,19.05 32.77,18.54 36.32,18.54 37.08,19.3 37.08,29.72 37.08,36.32 40.89,40.13 45.97,40.13 46.23,39.88 46.23,38.61 45.07,37.45 P3.B2

### Text on the board
tPlace: A | 35 | GND | 36 | EN | 23 | 25 | 19 | 26 | 18 | 3V3 | 3 | 1/T | 16 | 17/T | 21 | 22/K | 2 | 5 | 12 | 13 | 15 | 0 | 34 | HPWR | 5V | BAT
bPlace: A
tNames: M5R I2C MUX | M5R I2C / MUX V 0.1